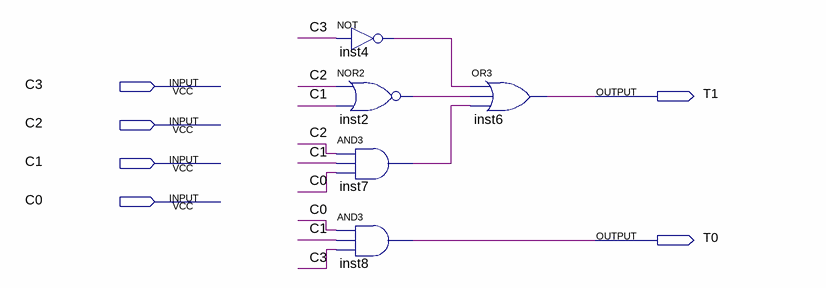
[diagram p0: schematic sheet]
// Quartus schematic CLlockmodule.bdf as structural Verilog: 5 symbols, 6 pins
module CLlockmodule (
  input  C3,
  input  C2,
  input  C1,
  input  C0,
  output T1,
  output T0
);

  wire inst2_out, inst4_out, inst7_out;

  not inst4 (inst4_out, C3);
  nor inst2 (inst2_out, C2, C1);
  and inst7 (inst7_out, C2, C1, C0);
  and inst8 (T0, C0, C1, C3);
  or inst6 (T1, inst4_out, inst2_out, inst7_out);
endmodule
